# EAGLE design Power Distribution (EAGLE 9.6.2)
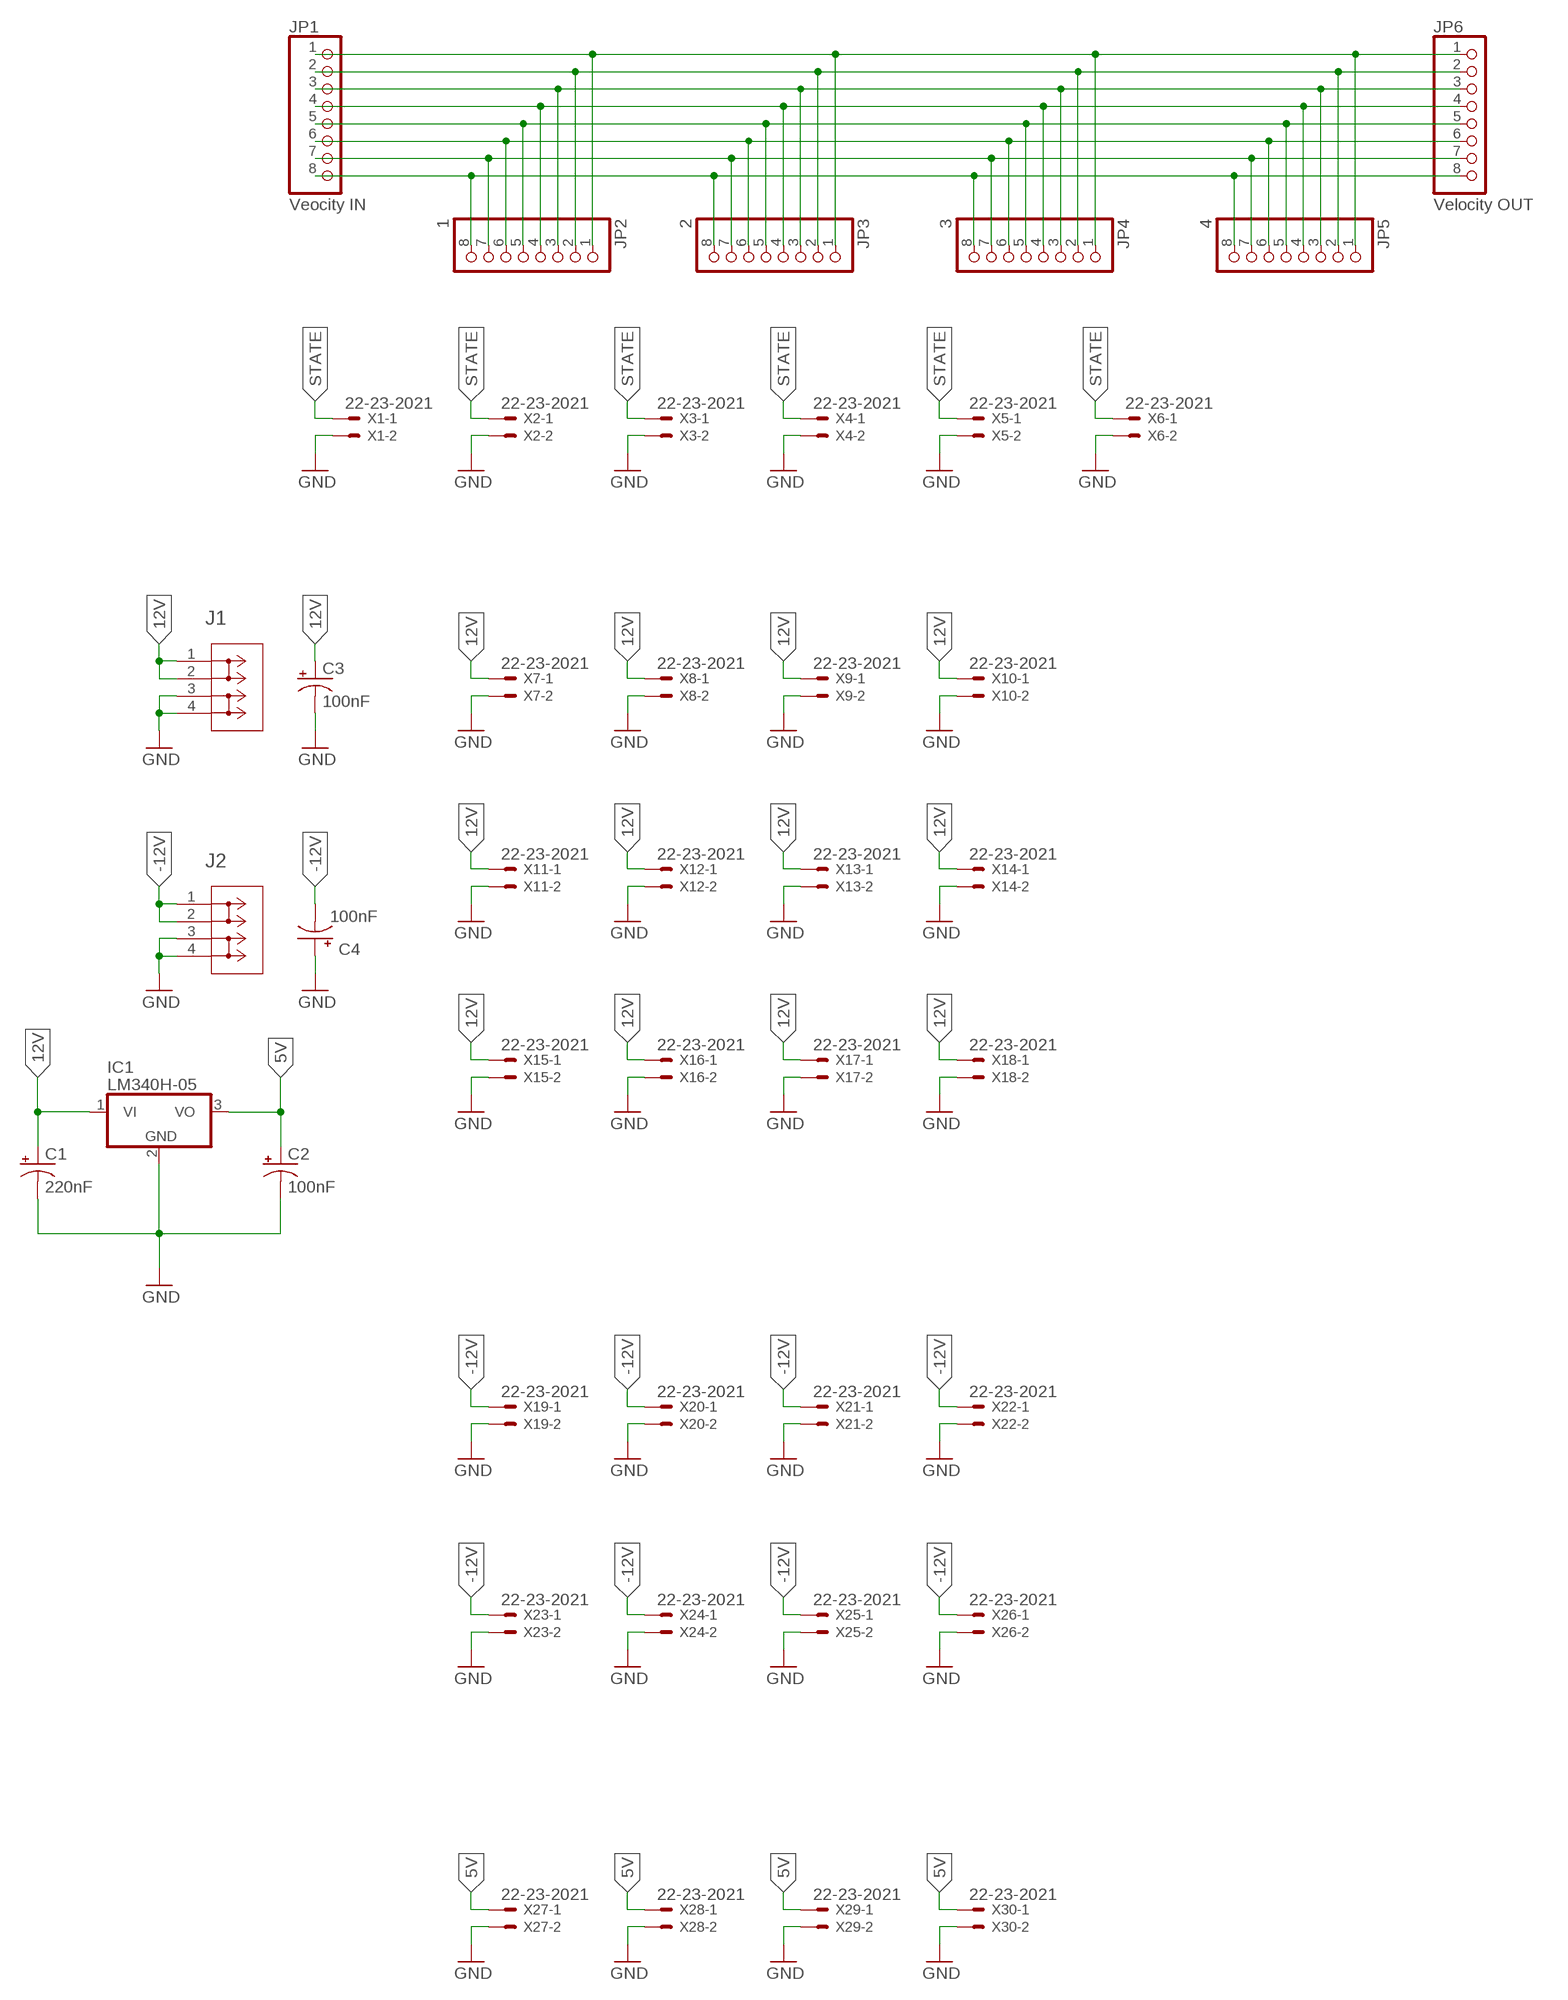
[diagram p0: schematic, sheet 1]

## Parts
C1  220nF  CPOL-USE2-5  [E2-5]
C2  100nF  CPOL-USE1.8-4  [E1,8-4]
C3  100nF  CPOL-USE1.8-4  [E1,8-4]
C4  100nF  CPOL-USE1.8-4  [E1,8-4]
IC1  LM340H-05  [TO220H]
J1  691256610002  [CONN_691256610002_WRE]
J2  691256610002  [CONN_691256610002_WRE]
JP1  Veocity IN  PINHD-1X8BIG  [1X08-BIG]
JP2  1  PINHD-1X8BIG  [1X08-BIG]
JP3  2  PINHD-1X8BIG  [1X08-BIG]
JP4  3  PINHD-1X8BIG  [1X08-BIG]
JP5  4  PINHD-1X8BIG  [1X08-BIG]
JP6  Velocity OUT  PINHD-1X8BIG  [1X08-BIG]
X1  22-23-2021  [22-23-2021]
X2  22-23-2021  [22-23-2021]
X3  22-23-2021  [22-23-2021]
X4  22-23-2021  [22-23-2021]
X5  22-23-2021  [22-23-2021]
X6  22-23-2021  [22-23-2021]
X7  22-23-2021  [22-23-2021]
X8  22-23-2021  [22-23-2021]
X9  22-23-2021  [22-23-2021]
X10  22-23-2021  [22-23-2021]
X11  22-23-2021  [22-23-2021]
X12  22-23-2021  [22-23-2021]
X13  22-23-2021  [22-23-2021]
X14  22-23-2021  [22-23-2021]
X15  22-23-2021  [22-23-2021]
X16  22-23-2021  [22-23-2021]
X17  22-23-2021  [22-23-2021]
X18  22-23-2021  [22-23-2021]
X19  22-23-2021  [22-23-2021]
X20  22-23-2021  [22-23-2021]
X21  22-23-2021  [22-23-2021]
X22  22-23-2021  [22-23-2021]
X23  22-23-2021  [22-23-2021]
X24  22-23-2021  [22-23-2021]
X25  22-23-2021  [22-23-2021]
X26  22-23-2021  [22-23-2021]
X27  22-23-2021  [22-23-2021]
X28  22-23-2021  [22-23-2021]
X29  22-23-2021  [22-23-2021]
X30  22-23-2021  [22-23-2021]

## Nets
5V: C2.+ IC1.3(VO) X27.1 X28.1 X29.1 X30.1
12V: C1.+ C3.+ IC1.1(VI) J1.1 J1.2 X7.1 X8.1 X9.1 X10.1 X11.1 X12.1 X13.1 X14.1 X15.1 X16.1 X17.1 X18.1
-12V: C4.- J2.1 J2.2 X19.1 X20.1 X21.1 X22.1 X23.1 X24.1 X25.1 X26.1
GND: C1.- C2.- C3.- C4.+ IC1.2(GND) J1.3 J1.4 J2.3 J2.4 X1.2 X2.2 X3.2 X4.2 X5.2 X6.2 X7.2 X8.2 X9.2 X10.2 X11.2 X12.2 X13.2 X14.2 X15.2 X16.2 X17.2 X18.2 X19.2 X20.2 X21.2 X22.2 X23.2 X24.2 X25.2 X26.2 X27.2 X28.2 X29.2 X30.2
N$1: JP1.1 JP2.1 JP3.1 JP4.1 JP5.1 JP6.1
N$2: JP1.2 JP2.2 JP3.2 JP4.2 JP5.2 JP6.2
N$3: JP1.3 JP2.3 JP3.3 JP4.3 JP5.3 JP6.3
N$4: JP1.4 JP2.4 JP3.4 JP4.4 JP5.4 JP6.4
N$5: JP1.5 JP2.5 JP3.5 JP4.5 JP5.5 JP6.5
N$6: JP1.6 JP2.6 JP3.6 JP4.6 JP5.6 JP6.6
N$7: JP1.7 JP2.7 JP3.7 JP4.7 JP5.7 JP6.7
N$8: JP1.8 JP2.8 JP3.8 JP4.8 JP5.8 JP6.8
STATE: X1.1 X2.1 X3.1 X4.1 X5.1 X6.1

## Library data of the parts
C1-C4 = adafruit:CPOL-US: POLARIZED CAPACITOR, American symbol
IC1 = linear:LM340?-*: Positive VOLTAGE REGULATOR Source: http://cache.national.com/ds/LM/LM340.pdf
J1 J2 = components:691256610002; COPYRIGHT: Copyright (C) 2024 Ultra Librarian. All rights reserved.; MANUFACTURER_PART_NUMBER: 691256610002; MFR_NAME: Wurth Electronics; TYPE: Wire to Board
JP1-JP6 = adafruit:PINHD-1X8: PIN HEADER
X1-X30 = con-molex:22-23-2021: .100" (2.54mm) Center Header - 2 Pin; MF: MOLEX; MPN: 22-23-2021; OC_FARNELL: 1462926; OC_NEWARK: 25C3832

## Board
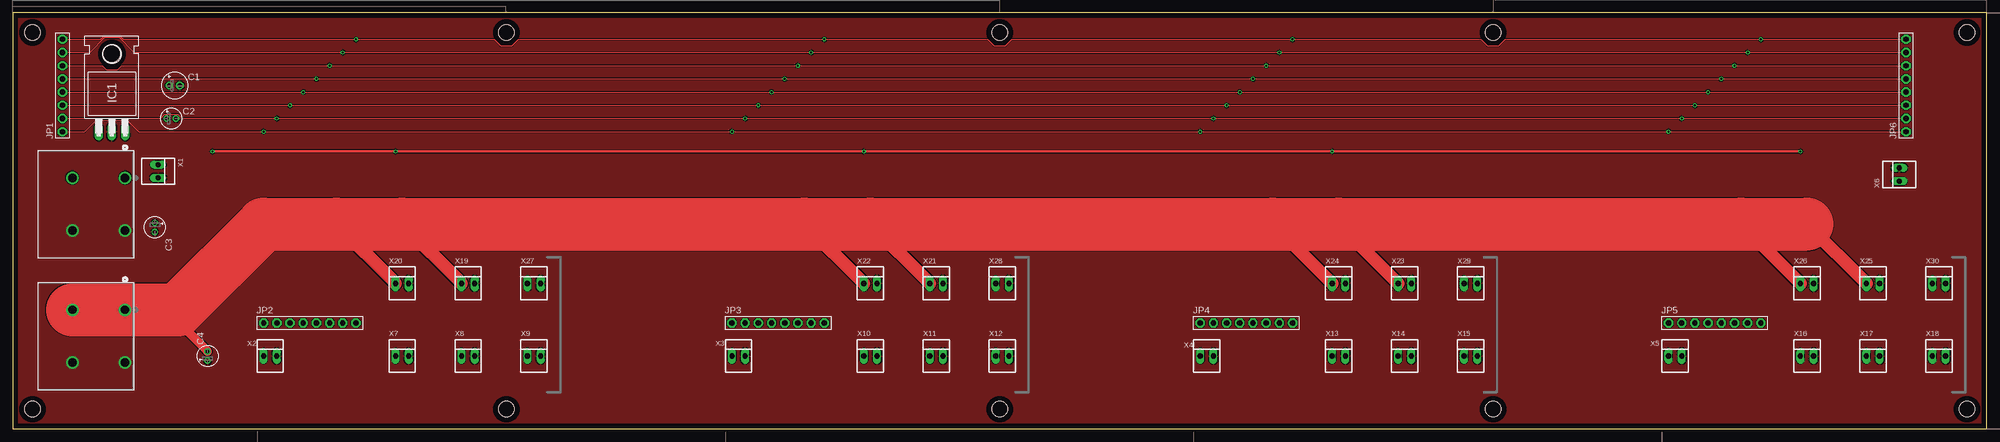
[diagram p1: board, top side]
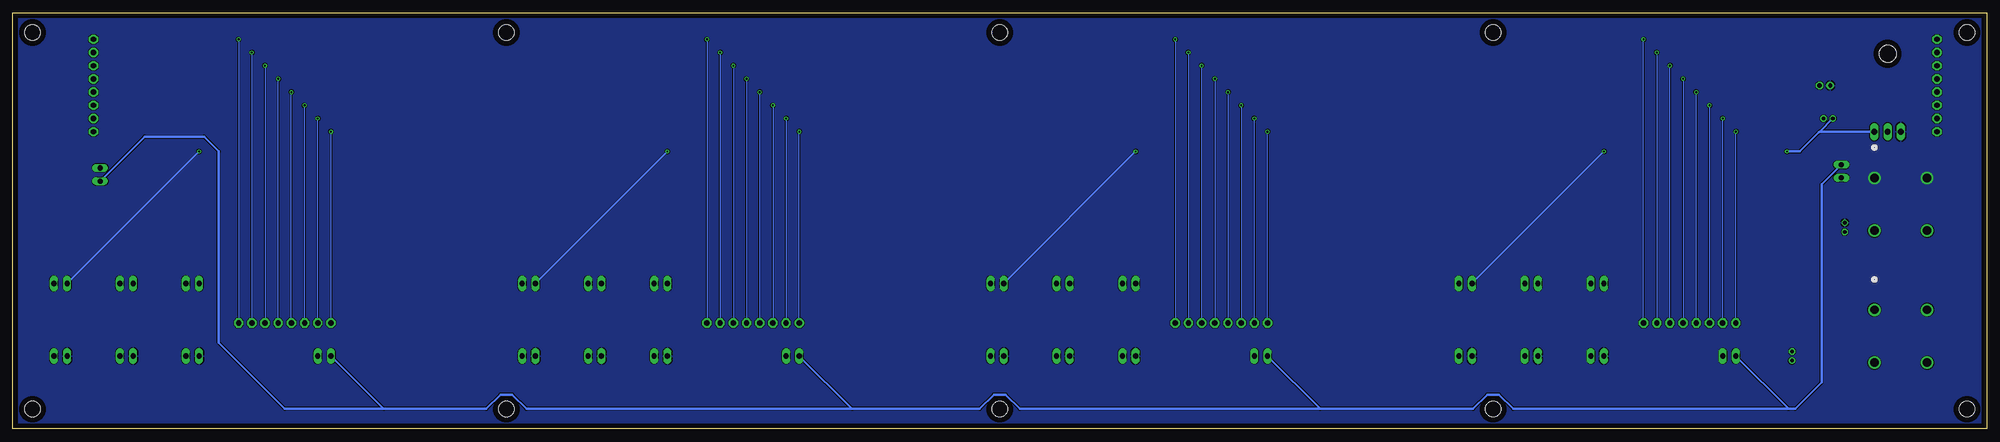
[diagram p2: board, bottom side, seen from below]

Size 380 x 80 mm. Coordinates in mm from the lower left corner, seen from the top.
Outline: 0,0 380,0 380,80 0,80 0,0
Copper layers (1*16): Top 0.035mm / dielectric 1.5mm / Bottom 0.035mm
Design rules "default": minimum track width 6mil, minimum drill 0.35mm, track to track 6mil, track to pad 6mil, pad to pad 6mil, via to via 6mil, smd to smd 6mil, copper to edge 40mil, drill to drill 6mil, minimum pad ring 10mil, minimum via ring 8mil, stop-mask expansion 4mil, vias tented up to drill 0mil, thermal gap 10mil
Holes 3 mm at 376.25,76.25 3.75,76.25 3.75,3.75 376.25,3.75 95,76.25 190,76.25 285,76.25 95,3.75 190,3.75 285,3.75

### Footprints (pad centres in the part's own frame; a part is rotated, then mirrored left to right if it is on the bottom)
E2-5 = drill 0.813 pad 1.422: + -1.016,0 | drill 0.813 pad 1.422 octagon: - 1.016,0
E1,8-4 = drill 0.711 pad 1.168: + -0.889,0 | drill 0.711 pad 1.168 octagon: - 0.889,0
TO220H = drill 1.118 long: 1 -2.54,-10.16; 2 0,-10.16; 3 2.54,-10.16 | hole 3.302: 0,4.826
CONN_691256610002_WRE = drill 1.6 pad 2.108: 1 0,0; 2 0,-10.16; 3 10.16,0; 4 10.16,-10.16
1X08-BIG = drill 1.016 pad 1.778 octagon: 1 -8.89,0; 2 -6.35,0; 3 -3.81,0; 4 -1.27,0; 5 1.27,0; 6 3.81,0; 7 6.35,0; 8 8.89,0
22-23-2021 = drill 1 long: 1 -1.27,0; 2 1.27,0

### Placement (x,y rotation side)
C1  31.11,66.04 0 top
C2  30.48,59.69 0 top
C3  27.3,38.73 270 top
C4  37.47,13.97 90 top
IC1  19.05,67.31 0 top
J1  21.59,48.26 270 top
J2  21.59,22.86 270 top
JP1  9.53,66.04 90 top
JP2  57.15,20.32 0 top
JP3  147.32,20.32 0 top
JP4  237.49,20.32 0 top
JP5  327.66,20.32 0 top
JP6  364.49,66.04 90 top
X1  27.94,49.53 270 top
X2  49.53,13.97 0 top
X3  139.7,13.97 0 top
X4  229.87,13.97 0 top
X5  320.04,13.97 0 top
X6  363.22,48.9 90 top
X7  74.93,13.97 0 top
X8  87.63,13.97 0 top
X9  100.33,13.97 0 top
X10  165.1,13.97 0 top
X11  177.8,13.97 0 top
X12  190.5,13.97 0 top
X13  255.27,13.97 0 top
X14  267.97,13.97 0 top
X15  280.67,13.97 0 top
X16  345.44,13.97 0 top
X17  358.14,13.97 0 top
X18  370.84,13.97 0 top
X19  87.63,27.94 0 top
X20  74.93,27.94 0 top
X21  177.8,27.94 0 top
X22  165.1,27.94 0 top
X23  267.97,27.94 0 top
X24  255.27,27.94 0 top
X25  358.14,27.94 0 top
X26  345.44,27.94 0 top
X27  100.33,27.94 0 top
X28  190.5,27.94 0 top
X29  280.67,27.94 0 top
X30  370.84,27.94 0 top

### Tracks (layer width: path | path; a pad name or v marks a point on that pad's centre or on a via)
5V  (via drill 0.35)
  Top 0.508: v38.42,53.34 v73.66,53.34 v163.83,53.34 v254,53.34 v344.17,53.34
  Bottom 0.305: v73.66,53.34 X27.1 | v163.83,53.34 X28.1 | X29.1 v254,53.34 | X30.1 v344.17,53.34
  Bottom 0.508: v38.42,53.34 35.94,53.34 32.26,57.02 32.13,57.15 | 32.13,57.15 C2.+ | IC1.3 32.13,57.15
12V
  pour Bottom: -5,85 -5,-5 385,-5 385,85
  pour Bottom (no thermals): 11.43,50.8 8.26,50.8 8.26,44.45 24.77,44.45 24.77,50.8
-12V
  Top 1.778: C4.- 29.46,22.86 J2.1
  Top 10.16: J2.2 J2.1 31.75,22.86 48.26,39.37 62.23,39.37 74.93,39.37 152.4,39.37 165.1,39.37 242.57,39.37 255.27,39.37 332.74,39.37 345.44,39.37
  Top 2.54: 74.93,39.37 X19.1 | 62.23,39.37 X20.1 | X22.1 152.4,39.37 | X21.1 165.1,39.37 | 345.44,39.37 X25.1 | X26.1 332.74,39.37 | X24.1 242.57,39.37 | X23.1 255.27,39.37
GND
  pour Top: -5,-10.16 -5,85 385,85 385,-10.16
  pour Top (no thermals): 8.26,40.64 24.77,40.64 24.77,34.29 8.26,34.29
  pour Top (no thermals): 8.26,15.24 24.77,15.24 24.77,8.89 8.26,8.89
N$1  (via drill 0.35)
  Top 0.152: JP1.1 13.85,57.15 16.07,59.37 22.03,59.37 24.25,57.15 v48.26,57.15 v138.43,57.15 v228.6,57.15 v318.77,57.15 JP6.1
  Bottom 0.152: JP2.1 v48.26,57.15 | JP3.1 v138.43,57.15 | JP4.1 v228.6,57.15 | JP5.1 v318.77,57.15
N$2  (via drill 0.35)
  Top 0.152: JP6.2 v321.31,59.69 v231.14,59.69 v140.97,59.69 v50.8,59.69 32.55,59.69 31.72,60.53 29.24,60.53 28.41,59.69 JP1.2
  Bottom 0.152: JP2.2 v50.8,59.69 | JP3.2 v140.97,59.69 | v231.14,59.69 JP4.2 | JP5.2 v321.31,59.69
N$3  (via drill 0.35)
  Top 0.152: JP1.3 v53.34,62.23 v143.51,62.23 v233.68,62.23 v323.85,62.23 JP6.3
  Bottom 0.152: v53.34,62.23 JP2.3 | v143.51,62.23 JP3.3 | v233.68,62.23 JP4.3 | JP5.3 v323.85,62.23
N$4  (via drill 0.35)
  Top 0.152: JP1.4 v55.88,64.77 v146.05,64.77 v236.22,64.77 v326.39,64.77 JP6.4
  Bottom 0.152: JP2.4 v55.88,64.77 | v146.05,64.77 JP3.4 | v236.22,64.77 JP4.4 | JP5.4 v326.39,64.77
N$5  (via drill 0.35)
  Top 0.152: JP1.5 v58.42,67.31 v148.59,67.31 v238.76,67.31 v328.93,67.31 JP6.5
  Bottom 0.152: v58.42,67.31 JP2.5 | v148.59,67.31 JP3.5 | v238.76,67.31 JP4.5 | JP5.5 v328.93,67.31
N$6  (via drill 0.35)
  Top 0.152: JP1.6 17.14,69.85 17.91,69.08 20.19,69.08 20.96,69.85 v60.96,69.85 v151.13,69.85 v241.3,69.85 v331.47,69.85 JP6.6
  Bottom 0.152: JP2.6 v60.96,69.85 | v151.13,69.85 JP3.6 | v241.3,69.85 JP4.6 | v331.47,69.85 JP5.6
N$7  (via drill 0.35)
  Top 0.152: JP6.7 v334.01,72.39 v243.84,72.39 v153.67,72.39 v63.5,72.39 23.31,72.39 20.5,75.2 17.6,75.2 14.79,72.39 JP1.7
  Bottom 0.152: v63.5,72.39 JP2.7 | v153.67,72.39 JP3.7 | v243.84,72.39 JP4.7 | v334.01,72.39 JP5.7
N$8  (via drill 0.35)
  Top 0.152: JP1.8 16.9,74.93 17.47,75.5 20.63,75.5 21.2,74.93 v66.04,74.93 92.65,74.93 93.93,73.66 96.07,73.66 97.35,74.93 v156.21,74.93 187.65,74.93 188.93,73.66 191.07,73.66 192.35,74.93 v246.38,74.93 282.65,74.93 283.93,73.66 286.07,73.66 287.35,74.93 v336.55,74.93 JP6.8
  Bottom 0.152: JP2.8 v66.04,74.93 | v156.21,74.93 JP3.8 | v246.38,74.93 JP4.8 | v336.55,74.93 JP5.8
STATE
  Bottom 0.508: 38.1,3.81 36.83,3.81 31.75,8.89 31.75,46.99 X1.1 | X2.1 38.1,3.81 | 308.61,3.81 X5.1 | X3.1 128.27,3.81 | X4.1 218.44,3.81 | 308.61,3.81 327.66,3.81 340.36,16.51 340.36,53.34 343.22,56.2 354.65,56.2 X6.1 | 128.27,3.81 98.86,3.81 96.15,6.52 93.85,6.52 91.14,3.81 38.1,3.81 | 128.27,3.81 186.14,3.81 188.85,6.52 191.15,6.52 193.86,3.81 218.44,3.81 | 218.44,3.81 281.14,3.81 283.85,6.52 286.15,6.52 288.86,3.81 308.61,3.81

### Text on the board
tDocu: MSD | MSD | LSD | LSD | STATE | GND | 12V | Power & Data Distribution Board for MIDI Controlled Player Piano / Designed By Kyle Schmerge github.com/kpzip | GND | STATE | GND | -12V | 5V | 5V | 5V | 5V | -12V | GND | -12V | GND | GND | -12V | GND | -12V | GND | GND | -12V | GND | -12V | GND | GND | -12V | GND | -12V | GND | GND | LSD | MSD | LSD | MSD | LSD | MSD | LSD | MSD | GND | 12V | 12V | 12V | 12V | 12V | 12V | 12V | 12V | 12V | 12V | 12V | 12V | GND | GND | GND | GND | GND | GND | GND | GND | GND | GND | GND | GND | GND | GND | GND | GND | STATE | STATE | STATE | STATE